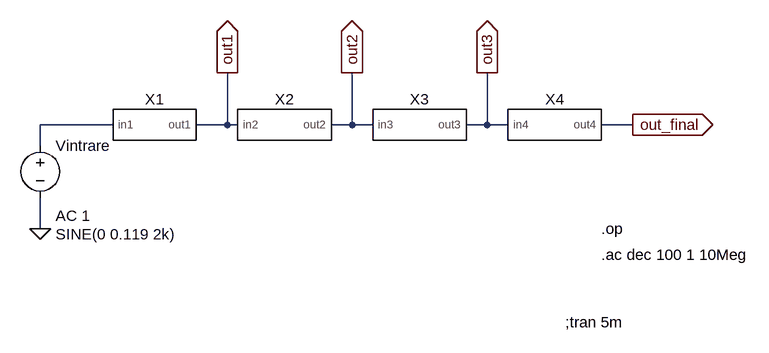
[diagram p0: schematic circuit_complet.asc]
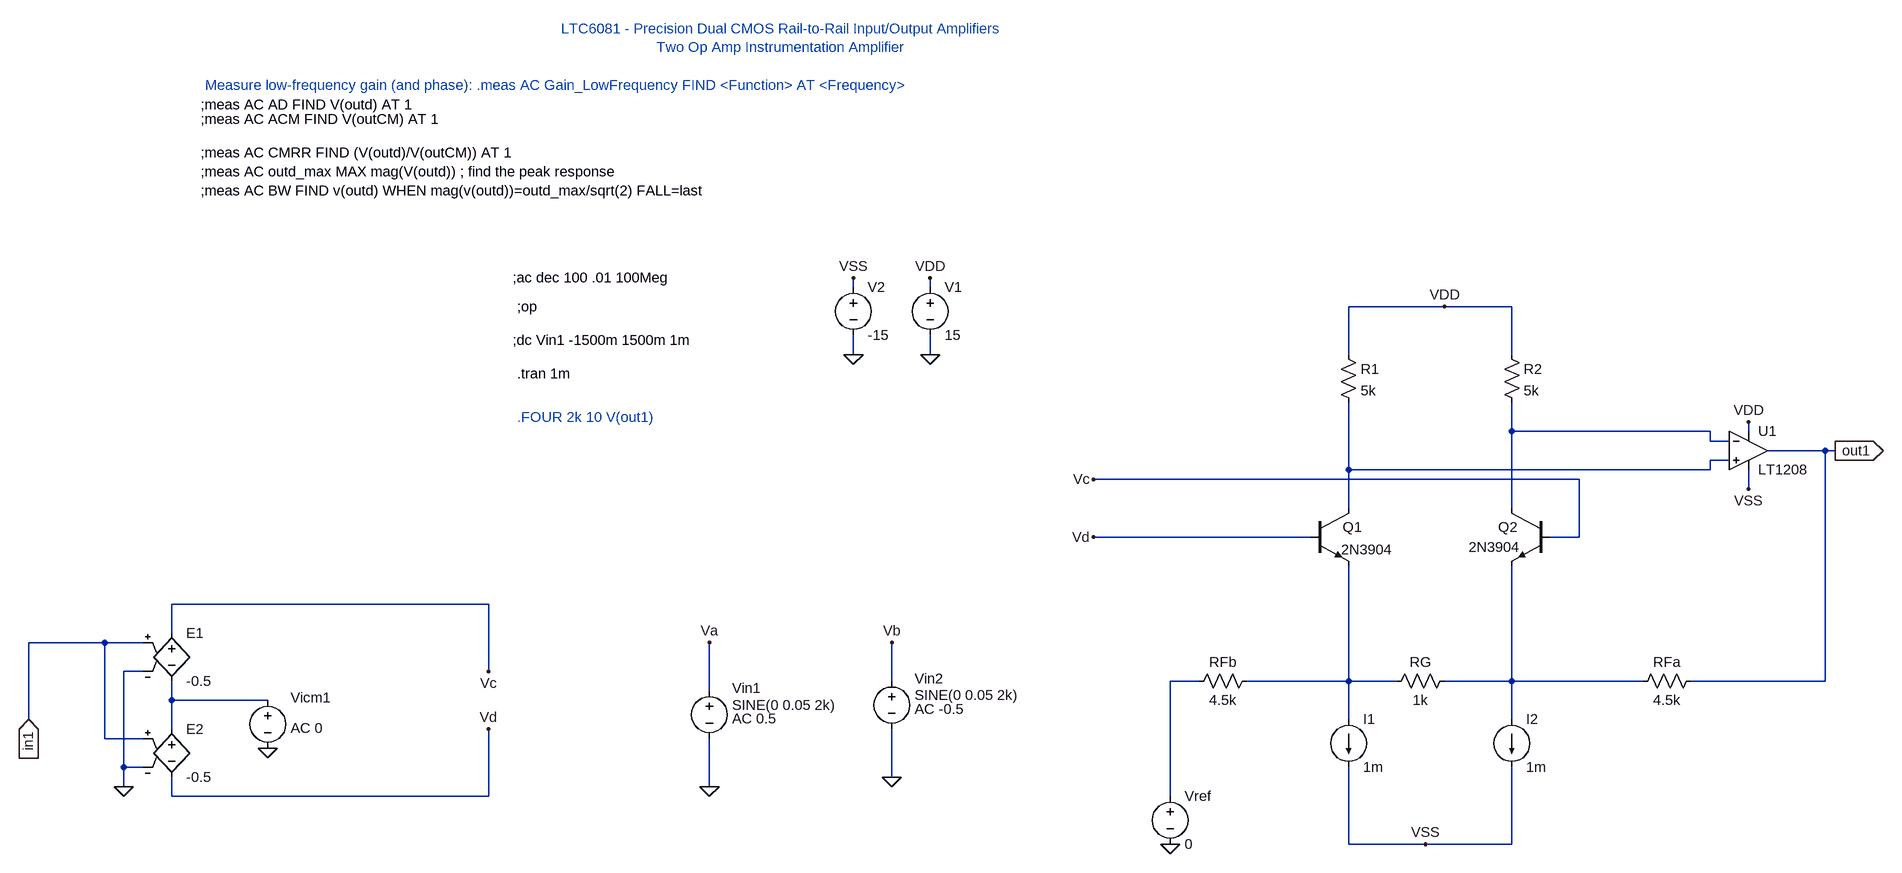
[diagram p1: sub-circuit etaj1.asc]
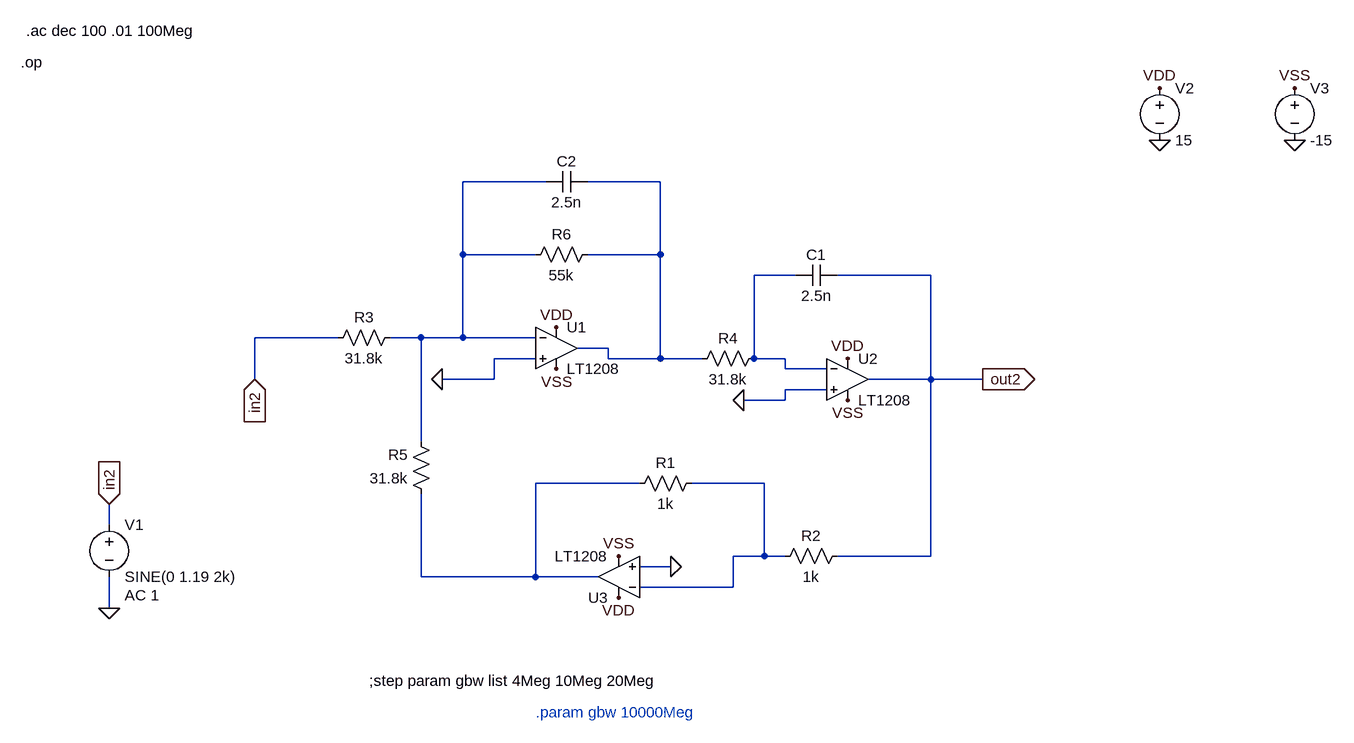
[diagram p2: sub-circuit etaj2.asc]
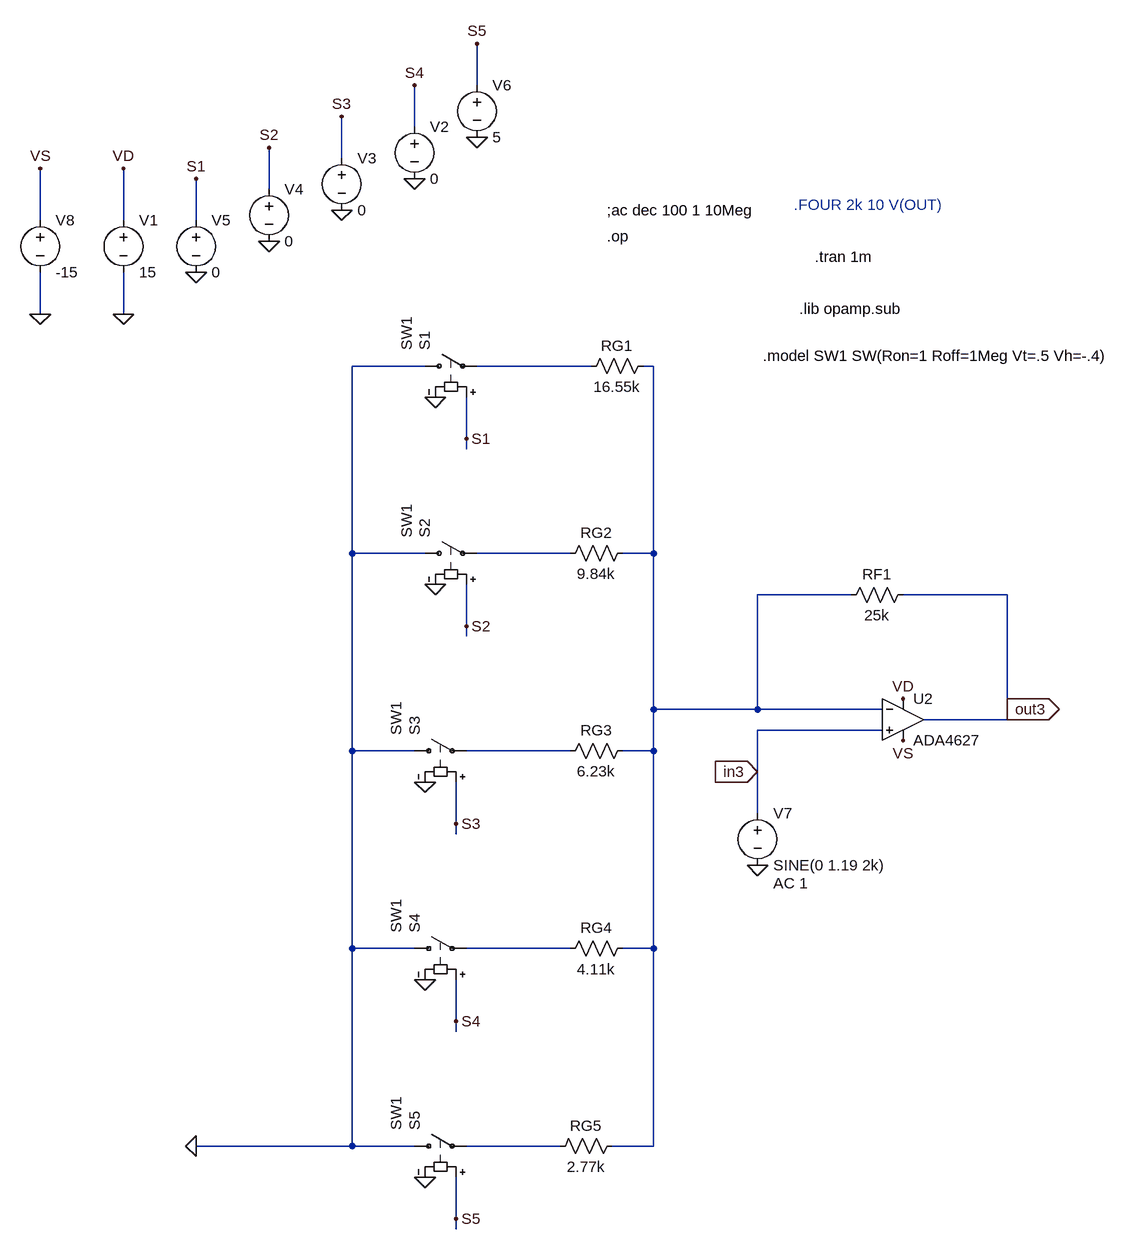
[diagram p3: sub-circuit etaj3.asc]
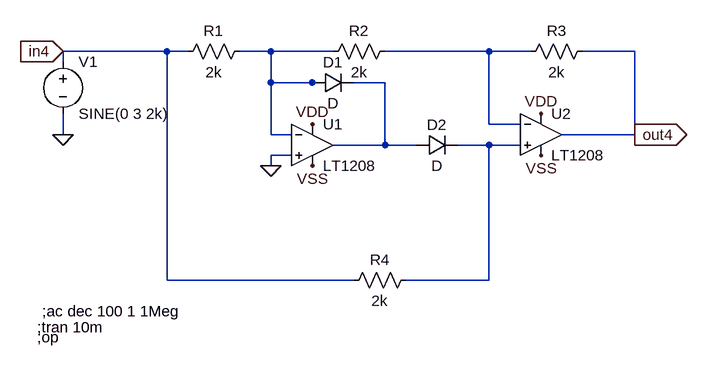
[diagram p4: sub-circuit etaj4.asc]
circuit_complet.asc, the LTspice schematic file:
Version 4
SHEET 1 880 680
WIRE -368 80 -480 80
WIRE -192 80 -192 0
WIRE -192 80 -240 80
WIRE -176 80 -192 80
WIRE 0 80 0 0
WIRE 0 80 -32 80
WIRE 32 80 0 80
WIRE 208 80 208 0
WIRE 208 80 176 80
WIRE 240 80 208 80
WIRE 432 80 384 80
WIRE -480 112 -480 80
WIRE -480 240 -480 192
FLAG -480 240 0
FLAG 432 80 out_final
IOPIN 432 80 Out
FLAG 208 0 out3
IOPIN 208 0 Out
FLAG 0 0 out2
IOPIN 0 0 Out
FLAG -192 0 out1
IOPIN -192 0 Out
SYMBOL voltage -480 96 R0
WINDOW 123 24 124 Left 2
WINDOW 39 0 0 Left 0
WINDOW 3 24 152 Left 2
SYMATTR Value2 AC 1
SYMATTR Value SINE(0 0.119 2k)
SYMATTR InstName Vintrare
SYMBOL etaj1 -304 80 R0
SYMATTR InstName X1
SYMBOL etaj2 -112 80 R0
SYMATTR InstName X2
SYMBOL etaj3 96 80 R0
SYMATTR InstName X3
SYMBOL etaj4 304 80 R0
SYMATTR InstName X4
TEXT 384 280 Left 2 !.ac dec 100 1 10Meg
TEXT 384 240 Left 2 !.op
TEXT 328 384 Left 2 !;tran 5m

etaj1.asc, the sub-circuit schematic file:
Version 4
SHEET 1 3624 1836
WIRE -3136 -272 -3136 -288
WIRE -3008 -272 -3008 -288
WIRE -2064 -240 -2224 -240
WIRE -1952 -240 -2064 -240
WIRE -3136 -160 -3136 -192
WIRE -3008 -160 -3008 -192
WIRE -2224 -160 -2224 -240
WIRE -1952 -160 -1952 -240
WIRE -1952 -32 -1952 -80
WIRE -1488 -32 -1952 -32
WIRE -1424 -32 -1424 -48
WIRE -1488 -16 -1488 -32
WIRE -1456 -16 -1488 -16
WIRE -1296 0 -1392 0
WIRE -1280 0 -1296 0
WIRE -1456 16 -1488 16
WIRE -2224 32 -2224 -80
WIRE -1488 32 -1488 16
WIRE -1488 32 -2224 32
WIRE -1840 48 -2736 48
WIRE -1424 64 -1424 32
WIRE -2224 96 -2224 32
WIRE -1952 96 -1952 -32
WIRE -2288 144 -2736 144
WIRE -1840 144 -1840 48
WIRE -1840 144 -1888 144
WIRE -3744 256 -4272 256
WIRE -4272 304 -4272 256
WIRE -4384 320 -4512 320
WIRE -4320 320 -4384 320
WIRE -4320 368 -4352 368
WIRE -3744 368 -3744 256
WIRE -3072 384 -3072 320
WIRE -2560 384 -2608 384
WIRE -2224 384 -2224 192
WIRE -2224 384 -2480 384
WIRE -2144 384 -2224 384
WIRE -1952 384 -1952 192
WIRE -1952 384 -2064 384
WIRE -1600 384 -1952 384
WIRE -1296 384 -1296 0
WIRE -1296 384 -1520 384
WIRE -3376 400 -3376 320
WIRE -4272 416 -4272 384
WIRE -4112 416 -4272 416
WIRE -4512 448 -4512 320
WIRE -2224 448 -2224 384
WIRE -1952 448 -1952 384
WIRE -4272 464 -4272 416
WIRE -4384 480 -4384 320
WIRE -4320 480 -4384 480
WIRE -4352 528 -4352 368
WIRE -4320 528 -4352 528
WIRE -3072 544 -3072 464
WIRE -4352 560 -4352 528
WIRE -3376 560 -3376 480
WIRE -4272 576 -4272 544
WIRE -3744 576 -3744 464
WIRE -3744 576 -4272 576
WIRE -2608 576 -2608 384
WIRE -2224 656 -2224 528
WIRE -2096 656 -2224 656
WIRE -1952 656 -1952 528
WIRE -1952 656 -2096 656
FLAG -3008 -160 0
FLAG -3008 -288 VDD
FLAG -3136 -160 0
FLAG -3136 -288 VSS
FLAG -1424 -48 VDD
FLAG -1424 64 VSS
FLAG -2064 -240 VDD
FLAG -2096 656 VSS
FLAG -3376 560 0
FLAG -3072 544 0
FLAG -2608 656 0
FLAG -3376 320 Va
FLAG -3072 320 Vb
FLAG -4352 560 0
FLAG -4112 496 0
FLAG -3744 368 Vc
FLAG -3744 464 Vd
FLAG -2736 48 Vc
FLAG -2736 144 Vd
FLAG -4512 448 in1
IOPIN -4512 448 In
FLAG -1280 0 out1
IOPIN -1280 0 Out
DATAFLAG -2224 -32 ""
DATAFLAG -1952 -48 ""
DATAFLAG -2224 336 ""
DATAFLAG -1952 304 ""
DATAFLAG -1296 112 ""
SYMBOL voltage -3008 -288 R0
WINDOW 123 0 0 Left 2
WINDOW 39 0 0 Left 2
SYMATTR InstName V1
SYMATTR Value 15
SYMBOL voltage -3136 -288 R0
WINDOW 123 0 0 Left 2
WINDOW 39 0 0 Left 2
SYMATTR InstName V2
SYMATTR Value -15
SYMBOL npn -2288 96 R0
WINDOW 0 54 32 Left 2
WINDOW 3 52 69 Left 2
SYMATTR InstName Q1
SYMATTR Value 2N3904
SYMBOL npn -1888 96 M0
WINDOW 0 54 32 Left 2
WINDOW 3 51 65 Left 2
SYMATTR InstName Q2
SYMATTR Value 2N3904
SYMBOL res -2240 -176 R0
SYMATTR InstName R1
SYMATTR Value 5k
SYMBOL res -1968 -176 R0
SYMATTR InstName R2
SYMATTR Value 5k
SYMBOL res -1504 368 R90
WINDOW 0 0 56 VBottom 2
WINDOW 3 32 56 VTop 2
SYMATTR InstName RFa
SYMATTR Value 4.5k
SYMBOL res -2048 368 R90
WINDOW 0 0 56 VBottom 2
WINDOW 3 32 56 VTop 2
SYMATTR InstName RG
SYMATTR Value 1k
SYMBOL res -2464 368 R90
WINDOW 0 0 56 VBottom 2
WINDOW 3 32 56 VTop 2
SYMATTR InstName RFb
SYMATTR Value 4.5k
SYMBOL current -2224 448 R0
WINDOW 123 0 0 Left 0
WINDOW 39 0 0 Left 0
SYMATTR InstName I1
SYMATTR Value 1m
SYMBOL current -1952 448 R0
WINDOW 123 0 0 Left 0
WINDOW 39 0 0 Left 0
SYMATTR InstName I2
SYMATTR Value 1m
SYMBOL voltage -3376 384 R0
WINDOW 123 38 63 Left 2
WINDOW 39 0 0 Left 2
WINDOW 0 38 12 Left 2
WINDOW 3 38 40 Left 2
SYMATTR Value2 AC 0.5
SYMATTR InstName Vin1
SYMATTR Value SINE(0 0.05 2k)
SYMBOL OpAmps\\LT1208 -1424 -64 R0
SYMATTR InstName U1
SYMBOL voltage -3072 368 R0
WINDOW 123 38 63 Left 2
WINDOW 39 0 0 Left 2
WINDOW 0 38 12 Left 2
WINDOW 3 38 40 Left 2
SYMATTR Value2 AC -0.5
SYMATTR InstName Vin2
SYMATTR Value SINE(0 0.05 2k)
SYMBOL voltage -2608 560 R0
WINDOW 123 0 0 Left 0
WINDOW 39 0 0 Left 0
SYMATTR InstName Vref
SYMATTR Value 0
SYMBOL e -4272 288 R0
SYMATTR InstName E1
SYMATTR Value -0.5
SYMBOL e -4272 448 R0
SYMATTR InstName E2
SYMATTR Value -0.5
SYMBOL voltage -4112 400 R0
WINDOW 123 38 63 Left 2
WINDOW 39 0 0 Left 2
WINDOW 0 38 12 Left 2
WINDOW 3 -188 38 Left 2
SYMATTR Value2 AC 0
SYMATTR InstName Vicm1
SYMATTR Value ""
TEXT -3704 -288 Left 2 !;ac dec 100 .01 100Meg
TEXT -4224 -1200 Left 2 !;meas AC AD FIND V(outd) AT 1
TEXT -4216 -1232 Left 2 ;Measure low-frequency gain (and phase): .meas AC Gain_LowFrequency FIND <Function> AT <Frequency>
TEXT -4224 -1176 Left 2 !;meas AC ACM FIND V(outCM) AT 1
TEXT -4224 -1120 Left 2 !;meas AC CMRR FIND (V(outd)/V(outCM)) AT 1
TEXT -3256 -1280 Bottom 2 ;LTC6081 - Precision Dual CMOS Rail-to-Rail Input/Output Amplifiers\nTwo Op Amp Instrumentation Amplifier
TEXT -4224 -1088 Left 2 !;meas AC outd_max MAX mag(V(outd)) ; find the peak response\n;meas AC BW FIND v(outd) WHEN mag(v(outd))=outd_max/sqrt(2) FALL=last
TEXT -3696 -240 Left 2 !;op
TEXT -3704 -184 Left 2 !;dc Vin1 -1500m 1500m 1m
TEXT -3696 -128 Left 2 !.tran 1m
TEXT -3696 -56 Left 2 ;.FOUR 2k 10 V(out1)

etaj2.asc, the sub-circuit schematic file:
Version 4
SHEET 1 1236 680
WIRE 16 -256 -112 -256
WIRE 192 -256 80 -256
WIRE -112 -144 -112 -256
WIRE 0 -144 -112 -144
WIRE 192 -144 192 -256
WIRE 192 -144 80 -144
WIRE 400 -112 336 -112
WIRE 608 -112 464 -112
WIRE -304 -16 -432 -16
WIRE -176 -16 -224 -16
WIRE -112 -16 -112 -144
WIRE -112 -16 -176 -16
WIRE 0 -16 -112 -16
WIRE 112 0 64 0
WIRE 0 16 -64 16
WIRE 112 16 112 0
WIRE 192 16 192 -144
WIRE 192 16 112 16
WIRE 256 16 192 16
WIRE 336 16 336 -112
WIRE 384 16 336 16
WIRE 384 32 384 16
WIRE 448 32 384 32
WIRE -432 48 -432 -16
WIRE -64 48 -64 16
WIRE -64 48 -144 48
WIRE 608 48 608 -112
WIRE 608 48 512 48
WIRE 688 48 608 48
WIRE 448 64 384 64
WIRE 384 80 384 64
WIRE 384 80 320 80
WIRE -176 144 -176 -16
WIRE 160 208 0 208
WIRE 352 208 240 208
WIRE -656 272 -656 240
WIRE 352 320 352 208
WIRE 352 320 304 320
WIRE 384 320 352 320
WIRE 608 320 608 48
WIRE 608 320 464 320
WIRE 208 336 160 336
WIRE -176 352 -176 224
WIRE 0 352 0 208
WIRE 0 352 -176 352
WIRE 96 352 0 352
WIRE 304 368 304 320
WIRE 304 368 160 368
WIRE -656 400 -656 352
FLAG -144 48 0
FLAG 320 80 0
FLAG 128 320 VSS
FLAG 128 384 VDD
FLAG 32 -32 VDD
FLAG 480 16 VDD
FLAG 32 32 VSS
FLAG 480 80 VSS
FLAG 208 336 0
FLAG -432 48 in2
IOPIN -432 48 In
FLAG 688 48 out2
IOPIN 688 48 Out
FLAG -656 240 in2
IOPIN -656 240 In
FLAG -656 400 0
FLAG 960 -320 0
FLAG 1168 -320 0
FLAG 960 -400 VDD
FLAG 1168 -400 VSS
SYMBOL cap 464 -128 R90
WINDOW 0 0 32 VBottom 2
WINDOW 3 32 32 VTop 2
SYMATTR InstName C1
SYMATTR Value 2.5n
SYMBOL res 256 192 R90
WINDOW 0 0 56 VBottom 2
WINDOW 3 32 56 VTop 2
SYMATTR InstName R1
SYMATTR Value 1k
SYMBOL res 480 304 R90
WINDOW 0 0 56 VBottom 2
WINDOW 3 32 56 VTop 2
SYMATTR InstName R2
SYMATTR Value 1k
SYMBOL res -208 -32 R90
WINDOW 0 0 56 VBottom 2
WINDOW 3 32 56 VTop 2
SYMATTR InstName R3
SYMATTR Value 31.8k
SYMBOL res 352 0 R90
WINDOW 0 0 56 VBottom 2
WINDOW 3 32 56 VTop 2
SYMATTR InstName R4
SYMATTR Value 31.8k
SYMBOL res -160 240 R180
WINDOW 0 36 76 Left 2
WINDOW 3 36 40 Left 2
SYMATTR InstName R5
SYMATTR Value 31.8k
SYMBOL res 96 -160 R90
WINDOW 0 0 56 VBottom 2
WINDOW 3 32 56 VTop 2
SYMATTR InstName R6
SYMATTR Value 55k
SYMBOL cap 80 -272 R90
WINDOW 0 0 32 VBottom 2
WINDOW 3 32 32 VTop 2
SYMATTR InstName C2
SYMATTR Value 2.5n
SYMBOL OpAmps\\LT1208 32 -64 R0
SYMATTR InstName U1
SYMBOL OpAmps\\LT1208 480 -16 R0
SYMATTR InstName U2
SYMBOL OpAmps\\LT1208 128 416 R180
SYMATTR InstName U3
SYMBOL voltage -656 256 R0
WINDOW 123 24 124 Left 2
WINDOW 39 0 0 Left 0
SYMATTR Value2 AC 1
SYMATTR InstName V1
SYMATTR Value SINE(0 1.19 2k)
SYMBOL voltage 960 -416 R0
WINDOW 123 0 0 Left 0
WINDOW 39 0 0 Left 0
SYMATTR InstName V2
SYMATTR Value 15
SYMBOL voltage 1168 -416 R0
WINDOW 123 0 0 Left 0
WINDOW 39 0 0 Left 0
SYMATTR InstName V3
SYMATTR Value -15
TEXT 0 560 Left 2 ;.param gbw 10000Meg
TEXT -256 512 Left 2 !;step param gbw list 4Meg 10Meg 20Meg
TEXT -784 -488 Left 2 !.ac dec 100 .01 100Meg
TEXT -792 -440 Left 2 !.op

etaj3.asc, the sub-circuit schematic file:
Version 4
SHEET 1 1720 1244
WIRE -64 -640 -64 -704
WIRE -160 -576 -160 -640
WIRE -272 -528 -272 -592
WIRE -384 -480 -384 -544
WIRE -736 -432 -736 -512
WIRE -608 -432 -608 -512
WIRE -496 -432 -496 -496
WIRE -736 -288 -736 -352
WIRE -608 -288 -608 -352
WIRE -144 -208 -256 -208
WIRE 112 -208 -64 -208
WIRE 208 -208 192 -208
WIRE -80 -96 -80 -160
WIRE -80 -80 -80 -96
WIRE -256 80 -256 -208
WIRE -144 80 -256 80
WIRE 80 80 -64 80
WIRE 208 80 208 -208
WIRE 208 80 160 80
WIRE 512 144 368 144
WIRE 752 144 592 144
WIRE -80 192 -80 128
WIRE -80 208 -80 192
WIRE 208 320 208 80
WIRE 368 320 368 144
WIRE 368 320 208 320
WIRE 560 320 368 320
WIRE 752 320 752 144
WIRE 752 336 752 320
WIRE 752 336 624 336
WIRE 560 352 368 352
WIRE -256 384 -256 80
WIRE -160 384 -256 384
WIRE 80 384 -80 384
WIRE 208 384 208 320
WIRE 208 384 160 384
WIRE 368 416 368 352
WIRE 368 480 368 416
WIRE -96 496 -96 432
WIRE -96 512 -96 496
WIRE -256 688 -256 384
WIRE -160 688 -256 688
WIRE 80 688 -80 688
WIRE 208 688 208 384
WIRE 208 688 160 688
WIRE -96 800 -96 736
WIRE -96 816 -96 800
WIRE -256 992 -256 688
WIRE -256 992 -496 992
WIRE -160 992 -256 992
WIRE 64 992 -80 992
WIRE 208 992 208 688
WIRE 208 992 144 992
WIRE -96 1104 -96 1040
WIRE -96 1120 -96 1104
FLAG -608 -288 0
FLAG -608 -512 VD
FLAG -496 -352 0
FLAG -384 -400 0
FLAG -272 -448 0
FLAG -160 -496 0
FLAG -496 -496 S1
FLAG -384 -544 S2
FLAG -272 -592 S3
FLAG -160 -640 S4
FLAG -64 -560 0
FLAG -64 -704 S5
FLAG 368 560 0
FLAG 592 304 VD
FLAG 592 368 VS
FLAG -496 992 0
FLAG -128 -160 0
FLAG -80 -96 S1
FLAG -128 128 0
FLAG -80 192 S2
FLAG -144 432 0
FLAG -96 496 S3
FLAG -144 736 0
FLAG -96 800 S4
FLAG -144 1040 0
FLAG -96 1104 S5
FLAG -736 -288 0
FLAG -736 -512 VS
FLAG 752 320 out3
IOPIN 752 320 Out
FLAG 368 416 in3
IOPIN 368 416 In
DATAFLAG -496 -464 ""
DATAFLAG -384 -512 ""
DATAFLAG -272 -560 ""
DATAFLAG -160 -608 ""
DATAFLAG -64 -672 ""
SYMBOL res 208 -224 R90
WINDOW 0 0 56 VBottom 2
WINDOW 3 32 56 VTop 2
SYMATTR InstName RG1
SYMATTR Value 16.55k
SYMBOL res 176 64 R90
WINDOW 0 0 56 VBottom 2
WINDOW 3 32 56 VTop 2
SYMATTR InstName RG2
SYMATTR Value 9.84k
SYMBOL res 176 368 R90
WINDOW 0 0 56 VBottom 2
WINDOW 3 32 56 VTop 2
SYMATTR InstName RG3
SYMATTR Value 6.23k
SYMBOL res 176 672 R90
WINDOW 0 0 56 VBottom 2
WINDOW 3 32 56 VTop 2
SYMATTR InstName RG4
SYMATTR Value 4.11k
SYMBOL voltage -608 -448 R0
WINDOW 123 0 0 Left 2
WINDOW 39 0 0 Left 2
SYMATTR InstName V1
SYMATTR Value 15
SYMBOL voltage -160 -592 R0
WINDOW 123 0 0 Left 0
WINDOW 39 0 0 Left 0
SYMATTR InstName V2
SYMATTR Value 0
SYMBOL voltage -272 -544 R0
WINDOW 123 0 0 Left 0
WINDOW 39 0 0 Left 0
SYMATTR InstName V3
SYMATTR Value 0
SYMBOL voltage -384 -496 R0
WINDOW 123 0 0 Left 0
WINDOW 39 0 0 Left 0
SYMATTR InstName V4
SYMATTR Value 0
SYMBOL voltage -496 -448 R0
WINDOW 123 0 0 Left 0
WINDOW 39 0 0 Left 0
SYMATTR InstName V5
SYMATTR Value 0
SYMBOL voltage -64 -656 R0
WINDOW 123 0 0 Left 0
WINDOW 39 0 0 Left 0
SYMATTR InstName V6
SYMATTR Value 5
SYMBOL res 608 128 R90
WINDOW 0 0 56 VBottom 2
WINDOW 3 32 56 VTop 2
SYMATTR InstName RF1
SYMATTR Value 25k
SYMBOL res 160 976 R90
WINDOW 0 0 56 VBottom 2
WINDOW 3 32 56 VTop 2
SYMATTR InstName RG5
SYMATTR Value 2.77k
SYMBOL voltage 368 464 R0
WINDOW 123 24 124 Left 2
WINDOW 39 0 0 Left 0
SYMATTR Value2 AC 1
SYMATTR InstName V7
SYMATTR Value SINE(0 1.19 2k)
SYMBOL sw -160 -208 R270
WINDOW 3 24 -12 Left 2
SYMATTR Value SW1
SYMATTR InstName S1
SYMBOL sw -160 80 R270
WINDOW 3 24 -12 Left 2
SYMATTR Value SW1
SYMATTR InstName S2
SYMBOL sw -176 384 R270
WINDOW 3 24 -12 Left 2
SYMATTR Value SW1
SYMATTR InstName S3
SYMBOL sw -176 688 R270
WINDOW 3 24 -12 Left 2
SYMATTR Value SW1
SYMATTR InstName S4
SYMBOL sw -176 992 R270
WINDOW 3 24 -12 Left 2
SYMATTR Value SW1
SYMATTR InstName S5
SYMBOL voltage -736 -448 R0
WINDOW 123 0 0 Left 2
WINDOW 39 0 0 Left 2
SYMATTR InstName V8
SYMATTR Value -15
SYMBOL OpAmps\\ADA4627 592 272 R0
SYMATTR InstName U2
TEXT 136 -448 Left 2 !;ac dec 100 1 10Meg
TEXT 136 -408 Left 2 !.op
TEXT 424 -456 Left 2 ;.FOUR 2k 10 V(OUT)
TEXT 456 -376 Left 2 !.tran 1m
TEXT 432 -296 Left 2 !.lib opamp.sub
TEXT 376 -224 Left 2 !.model SW1 SW(Ron=1 Roff=1Meg Vt=.5 Vh=-.4)

etaj4.asc, the sub-circuit schematic file:
Version 4
SHEET 1 880 680
WIRE -144 -64 -304 -64
WIRE -112 -64 -144 -64
WIRE 16 -64 -32 -64
WIRE 112 -64 16 -64
WIRE 352 -64 192 -64
WIRE 416 -64 352 -64
WIRE 576 -64 496 -64
WIRE -304 -48 -304 -64
WIRE 16 -16 16 -64
WIRE 80 -16 16 -16
WIRE 96 -16 80 -16
WIRE 192 -16 144 -16
WIRE 352 48 352 -64
WIRE 400 48 352 48
WIRE -304 64 -304 32
WIRE 16 64 16 -16
WIRE 48 64 16 64
WIRE 576 64 576 -64
WIRE 576 64 464 64
WIRE 192 80 192 -16
WIRE 192 80 112 80
WIRE 240 80 192 80
WIRE 352 80 304 80
WIRE 400 80 352 80
WIRE 48 96 16 96
WIRE 16 112 16 96
WIRE -144 288 -144 -64
WIRE 144 288 -144 288
WIRE 352 288 352 80
WIRE 352 288 224 288
FLAG 16 112 0
FLAG -304 64 0
FLAG 80 48 VDD
FLAG 432 32 VDD
FLAG 80 112 VSS
FLAG 432 96 VSS
FLAG 576 64 out4
IOPIN 576 64 Out
FLAG -304 -64 in4
IOPIN -304 -64 In
SYMBOL OpAmps\\LT1208 80 16 R0
SYMATTR InstName U1
SYMBOL OpAmps\\LT1208 432 0 R0
SYMATTR InstName U2
SYMBOL res -16 -80 R90
WINDOW 0 0 56 VBottom 2
WINDOW 3 32 56 VTop 2
SYMATTR InstName R1
SYMATTR Value 2k
SYMBOL res 208 -80 R90
WINDOW 0 0 56 VBottom 2
WINDOW 3 32 56 VTop 2
SYMATTR InstName R2
SYMATTR Value 2k
SYMBOL res 512 -80 R90
WINDOW 0 0 56 VBottom 2
WINDOW 3 32 56 VTop 2
SYMATTR InstName R3
SYMATTR Value 2k
SYMBOL res 240 272 R90
WINDOW 0 0 56 VBottom 2
WINDOW 3 32 56 VTop 2
SYMATTR InstName R4
SYMATTR Value 2k
SYMBOL voltage -304 -64 R0
WINDOW 123 0 0 Left 0
WINDOW 39 0 0 Left 0
SYMATTR InstName V1
SYMATTR Value SINE(0 3 2k)
SYMBOL diode 80 0 R270
WINDOW 0 32 32 VTop 2
WINDOW 3 0 32 VBottom 2
SYMATTR InstName D1
SYMBOL diode 240 96 R270
WINDOW 0 32 32 VTop 2
WINDOW 3 0 32 VBottom 2
SYMATTR InstName D2
TEXT -336 336 Left 2 !;ac dec 100 1 1Meg
TEXT -344 360 Left 2 !;tran 10m
TEXT -344 376 Left 2 !;op

The netlist it stands for:
* circuit_complet.asc
Vintrare N001 0 SINE(0 0.119 2k) AC 1
XX1 N001 out1 etaj1
XX2 out1 out2 etaj2
XX3 out2 out3 etaj3
XX4 out3 out_final etaj4

* block symbol definitions
.subckt etaj1 in1 out1
V1 VDD 0 15
V2 VSS 0 -15
Q1 N002 Vd N004 0 2N3904
Q2 N001 Vc N005 0 2N3904
R1 VDD N002 5k
R2 VDD N001 5k
RFa out1 N005 4.5k
RG N005 N004 1k
RFb N004 N003 4.5k
I1 N004 VSS 1m
I2 N005 VSS 1m
Vin1 Va 0 SINE(0 0.05 2k) AC 0.5
XU1 N002 N001 VDD VSS out1 LT1208  ; pins In+ In- V+ V- OUT
Vin2 Vb 0 SINE(0 0.05 2k) AC -0.5
Vref N003 0 0
E1 Vc N006 in1 0 -0.5
E2 N006 Vd in1 0 -0.5
Vicm1 N006 0 AC 0
;ac dec 100 .01 100Meg
;meas AC AD FIND V(outd) AT 1
* Measure low-frequency gain (and phase): .meas AC Gain_LowFrequency FIND <Function> AT <Frequency>
;meas AC ACM FIND V(outCM) AT 1
;meas AC CMRR FIND (V(outd)/V(outCM)) AT 1
* LTC6081 - Precision Dual CMOS Rail-to-Rail Input/Output Amplifiers
* Two Op Amp Instrumentation Amplifier
;meas AC outd_max MAX mag(V(outd)) ; find the peak response
;meas AC BW FIND v(outd) WHEN mag(v(outd))=outd_max/sqrt(2) FALL=last
;op
;dc Vin1 -1500m 1500m 1m
.tran 1m
* .FOUR 2k 10 V(out1)
.ends etaj1

.subckt etaj2 in2 out2
C1 out2 N003 2.5n
R1 N005 N004 1k
R2 out2 N005 1k
R3 N001 in2 31.8k
R4 N003 N002 31.8k
R5 N004 N001 31.8k
R6 N002 N001 55k
C2 N002 N001 2.5n
XU1 0 N001 VDD VSS N002 LT1208  ; pins In+ In- V+ V- OUT
XU2 0 N003 VDD VSS out2 LT1208  ; pins In+ In- V+ V- OUT
XU3 0 N005 VDD VSS N004 LT1208  ; pins In+ In- V+ V- OUT
V1 in2 0 SINE(0 1.19 2k) AC 1
V2 VDD 0 15
V3 VSS 0 -15
* .param gbw 10000Meg
;step param gbw list 4Meg 10Meg 20Meg
.ac dec 100 .01 100Meg
.op
.ends etaj2

.subckt etaj3 in3 out3
RG1 N002 N001 16.55k
RG2 N002 N003 9.84k
RG3 N002 N004 6.23k
RG4 N002 N005 4.11k
V1 VD 0 15
V2 S4 0 0
V3 S3 0 0
V4 S2 0 0
V5 S1 0 0
V6 S5 0 5
RF1 out3 N002 25k
RG5 N002 N006 2.77k
V7 in3 0 SINE(0 1.19 2k) AC 1
S1 0 N001 S1 0 SW1
S2 0 N003 S2 0 SW1
S3 0 N004 S3 0 SW1
S4 0 N005 S4 0 SW1
S5 0 N006 S5 0 SW1
V8 VS 0 -15
XU2 in3 N002 VD VS out3 ADA4627  ; pins In+ In- V+ V- OUT
;ac dec 100 1 10Meg
.op
* .FOUR 2k 10 V(OUT)
.tran 1m
.lib opamp.sub
.model SW1 SW(Ron=1 Roff=1Meg Vt=.5 Vh=-.4)
.ends etaj3

.subckt etaj4 in4 out4
XU1 0 N001 VDD VSS N003 LT1208  ; pins In+ In- V+ V- OUT
XU2 N004 N002 VDD VSS out4 LT1208  ; pins In+ In- V+ V- OUT
R1 N001 in4 2k
R2 N002 N001 2k
R3 out4 N002 2k
R4 N004 in4 2k
V1 in4 0 SINE(0 3 2k)
D1 N001 N003 D
D2 N003 N004 D
;ac dec 100 1 1Meg
;tran 10m
;op
.ends etaj4

.model D D
.lib standard.dio
.model NPN NPN
.model PNP PNP
.lib standard.bjt
.ac dec 100 1 10Meg
.op
;tran 5m
.backanno
.end

* Results of the author's LTspice run, read from the files saved beside the schematic
* From the log:
*   Semiconductor Device Operating Points:
*                           --- Diodes ---
*   Name:   d:x1:u1:5   d:x1:u1:6   d:x1:u1:3   d:x1:u1:1   d:x1:u1:2
*   Model:   x1:u1:y     x1:u1:y    x1:u1:dc   x1:u1:dbias x1:u1:dbias
*   Id:     -4.90e-19    4.90e-19    6.32e-03   -4.00e-06   -4.00e-06
*   Vd:     -4.90e-07    4.90e-07    3.00e+01   -2.57e+01   -2.57e+01
*   Req:     1.00e-12    1.00e-12    1.00e-02    1.00e-03    1.00e-03
*   CAP:     0.00e+00    0.00e+00    0.00e+00    0.00e+00    0.00e+00
*   Name:   d:x2:u1:5   d:x2:u1:6   d:x2:u1:3   d:x2:u1:1   d:x2:u1:2
*   Model:   x2:u1:y     x2:u1:y    x2:u1:dc   x2:u1:dbias x2:u1:dbias
*   Id:      4.55e-16   -4.55e-16    6.32e-03   -4.00e-06   -4.00e-06
*   Vd:      4.54e-04   -4.54e-04    3.00e+01   -1.50e+01   -1.50e+01
*   Req:     1.00e-12    1.00e-12    1.00e-02    1.00e-03    1.00e-03
*   CAP:     0.00e+00    0.00e+00    0.00e+00    0.00e+00    0.00e+00
*   Name:   d:x2:u2:5   d:x2:u2:6   d:x2:u2:3   d:x2:u2:1   d:x2:u2:2
*   Model:   x2:u2:y     x2:u2:y    x2:u2:dc   x2:u2:dbias x2:u2:dbias
*   Id:     -1.01e-12    1.33e-05    6.32e-03   -4.00e-06   -4.00e-06
*   Vd:     -1.01e+00    1.01e+00    3.00e+01   -1.50e+01   -1.51e+01
*   Req:     1.00e-12    1.00e-03    1.00e-02    1.00e-03    1.00e-03
*   CAP:     0.00e+00    0.00e+00    0.00e+00    0.00e+00    0.00e+00
*   Name:   d:x2:u3:5   d:x2:u3:6   d:x2:u3:3   d:x2:u3:1   d:x2:u3:2
*   Model:   x2:u3:y     x2:u3:y    x2:u3:dc   x2:u3:dbias x2:u3:dbias
*   Id:      2.29e-16   -2.29e-16    6.32e-03   -4.00e-06   -4.00e-06
*   Vd:      2.29e-04   -2.29e-04    3.00e+01   -1.50e+01   -1.50e+01
*   Req:     1.00e-12    1.00e-12    1.00e-02    1.00e-03    1.00e-03
*   CAP:     0.00e+00    0.00e+00    0.00e+00    0.00e+00    0.00e+00
*   Name:  d:x3:u2:i1   d:x3:u2:1   d:x3:u2:2   d:x3:u2:3   d:x3:u2:4
*   Model:  x3:u2:dx    x3:u2:dx    x3:u2:dx    x3:u2:dx    x3:u2:dx
*   Id:     -1.04e-11   -2.54e-11    1.10e-04   -5.17e-12    1.01e-02
*   Vd:     -1.04e+01   -2.54e+01    6.57e-01   -5.16e+00    7.74e-01
*   Req:     1.00e+12    1.00e+12    2.36e+02    1.00e+12    2.57e+00
*   CAP:     2.97e-13    1.95e-13    1.64e-12    4.03e-13    1.80e-12
*   Name:   d:x3:u2:5   d:x3:u2:6  d:x3:u2:n1  d:x3:u2:n2  d:x3:u2:n3
*   Model:  x3:u2:dx    x3:u2:dx    x3:u2:den   x3:u2:den   x3:u2:din
*   Id:     -2.08e-11    3.17e-02    8.63e-04    8.63e-04    1.26e-04
*   Vd:     -2.08e+01    8.04e-01    2.00e+00    2.00e+00    2.00e+00
*   Req:     1.00e+12    8.15e-01    3.00e+01    3.00e+01    2.06e+02
*   CAP:     2.14e-13    1.84e-12    0.00e+00    0.00e+00    0.00e+00
*   Name:  d:x3:u2:n4  d:x3:u2:n5  d:x3:u2:n6   d:x3:u2:7   d:x3:u2:8
*   Model:  x3:u2:din   x3:u2:din   x3:u2:din   x3:u2:dy    x3:u2:dy
*   Id:      1.26e-04    1.26e-04    1.26e-04   -3.17e-02   -2.92e-11
*   Vd:      2.00e+00    2.00e+00    2.00e+00   -5.08e+01   -2.92e+01
*   Req:     2.06e+02    2.06e+02    2.06e+02    8.15e-01    1.00e+12
*   CAP:     0.00e+00    0.00e+00    0.00e+00    1.39e-13    1.82e-13
*   Name:   d:x4:u1:5   d:x4:u1:6   d:x4:u1:3   d:x4:u1:1   d:x4:u1:2
*   Model:   x4:u1:y     x4:u1:y    x4:u1:dc   x4:u1:dbias x4:u1:dbias
*   Id:      1.08e-17   -1.08e-17    2.34e-19    2.54e-12    6.75e-13
*   Vd:      1.08e-05   -1.08e-05    2.34e-10    2.54e-09    6.75e-10
*   Req:     1.00e-12    1.00e-12    1.00e-09    1.00e-03    1.00e-03
*   CAP:     0.00e+00    0.00e+00    0.00e+00    0.00e+00    0.00e+00
*   Name:   d:x4:u2:5   d:x4:u2:6   d:x4:u2:3   d:x4:u2:1   d:x4:u2:2
*   Model:   x4:u2:y     x4:u2:y    x4:u2:dc   x4:u2:dbias x4:u2:dbias
*   Id:      1.08e-17   -1.08e-17    2.34e-19    8.46e-13    1.43e-13
*   Vd:      1.08e-05   -1.08e-05    2.34e-10    8.46e-10    1.43e-10
*   Req:     1.00e-12    1.00e-12    1.00e-09    1.00e-03    1.00e-03
*   CAP:     0.00e+00    0.00e+00    0.00e+00    0.00e+00    0.00e+00
*   Name:    d:x4:1      d:x4:2
*   Model:      d           d
*   Id:     -1.10e-21    1.33e-21
*   Vd:     -7.92e-10    9.63e-10
*   Req:     7.21e+11    7.21e+11
*   CAP:     0.00e+00    0.00e+00
*                           --- Bipolar Transistors ---
*   Name:     q:x1:1      q:x1:2
*   Model:    2n3904      2n3904
*   Ib:       2.57e-06    2.57e-06
*   Ic:       8.53e-04    8.53e-04
*   Vbe:      6.49e-01    6.49e-01
*   Vbc:     -1.07e+01   -1.07e+01
*   Vce:      1.14e+01    1.14e+01
*   BetaDC:   3.31e+02    3.31e+02
*   Gm:       3.29e-02    3.29e-02
*   Rpi:      1.00e+04    1.00e+04
*   Rx:       2.00e+01    2.00e+01
*   Ro:       1.30e+05    1.30e+05
*   Cbe:      2.40e-11    2.40e-11
*   Cbc:      1.63e-12    1.63e-12
*   Cjs:      0.00e+00    0.00e+00
*   BetaAC:   3.31e+02    3.31e+02
*   Cbx:      0.00e+00    0.00e+00
*   Ft:       2.04e+08    2.04e+08
*                           --- JFET Transistors ---
*   Name:   j:x3:u2:1   j:x3:u2:2
*   Model:  x3:u2:jx    x3:u2:jx
*   Id:      1.35e-03    1.35e-03
*   Vgs:    -8.68e-01   -8.69e-01
*   Vds:     1.21e+01    1.21e+01
*   Gm:      4.29e-03    4.28e-03
*   Gds:     0.00e+00    0.00e+00
*   Cgs:     1.10e-12    1.10e-12
*   Cgd:     4.01e-13    4.01e-13
*                           --- VDMOSFET Transistors ---
*   Name:       m:x1:u1:1   m:x1:u1:2   m:x2:u1:1   m:x2:u1:2   m:x2:u2:1
*   Model:       x1:u1:n     x1:u1:p     x2:u1:n     x2:u1:p     x2:u2:n
*   Id:          6.75e-04   -6.75e-04    6.79e-04   -6.71e-04    1.50e-11
*   Vgs:        -4.90e-07   -4.90e-07    4.54e-04    4.54e-04   -1.01e+00
*   Vds:         1.50e+01   -1.50e+01    1.48e+01   -1.52e+01    1.50e+01
*   Vth:        -1.50e-01    1.50e-01   -1.50e-01    1.50e-01   -1.50e-01
*   Gm:          9.00e-03    9.00e-03    9.03e-03    8.97e-03    0.00e+00
*   Gds:         0.00e+00    0.00e+00    0.00e+00    0.00e+00    0.00e+00
*   Cgs:         0.00e+00    0.00e+00    0.00e+00    0.00e+00    0.00e+00
*   Cgd:         0.00e+00    0.00e+00    0.00e+00    0.00e+00    0.00e+00
*   Cbody:       0.00e+00    0.00e+00    0.00e+00    0.00e+00    0.00e+00
*   Name:       m:x2:u2:2   m:x2:u3:1   m:x2:u3:2   m:x4:u1:1   m:x4:u1:2
*   Model:       x2:u2:p     x2:u3:n     x2:u3:p     x4:u1:n     x4:u1:p
*   Id:         -4.05e-02    6.77e-04   -6.73e-04    1.05e-12   -1.05e-12
*   Vgs:        -1.01e+00    2.29e-04    2.29e-04    1.08e-05    1.08e-05
*   Vds:        -1.50e+01    1.50e+01   -1.50e+01    1.17e-10   -1.17e-10
*   Vth:         1.50e-01   -1.50e-01    1.50e-01   -1.50e-01    1.50e-01
*   Gm:          6.97e-02    9.01e-03    8.99e-03    7.01e-12    7.01e-12
*   Gds:         0.00e+00    0.00e+00    0.00e+00    9.00e-03    9.00e-03
*   Cgs:         0.00e+00    0.00e+00    0.00e+00    0.00e+00    0.00e+00
*   Cgd:         0.00e+00    0.00e+00    0.00e+00    0.00e+00    0.00e+00
*   Cbody:       0.00e+00    0.00e+00    0.00e+00    0.00e+00    0.00e+00
*   Name:       m:x4:u2:1   m:x4:u2:2
*   Model:       x4:u2:n     x4:u2:p
*   Id:          1.11e-12   -9.89e-13
*   Vgs:         1.08e-05    1.08e-05
*   Vds:         1.24e-10   -1.10e-10
*   Vth:        -1.50e-01    1.50e-01
*   Gm:          7.43e-12    6.59e-12
*   Gds:         9.00e-03    9.00e-03
*   Cgs:         0.00e+00    0.00e+00
*   Cgd:         0.00e+00    0.00e+00
*   Cbody:       0.00e+00    0.00e+00
*   Ignoring empty pin current: Ix(x1:in1)
*   Ignoring empty pin current: Ix(x1:in1)